# Altium project keyboardV0.1.PrjPCB
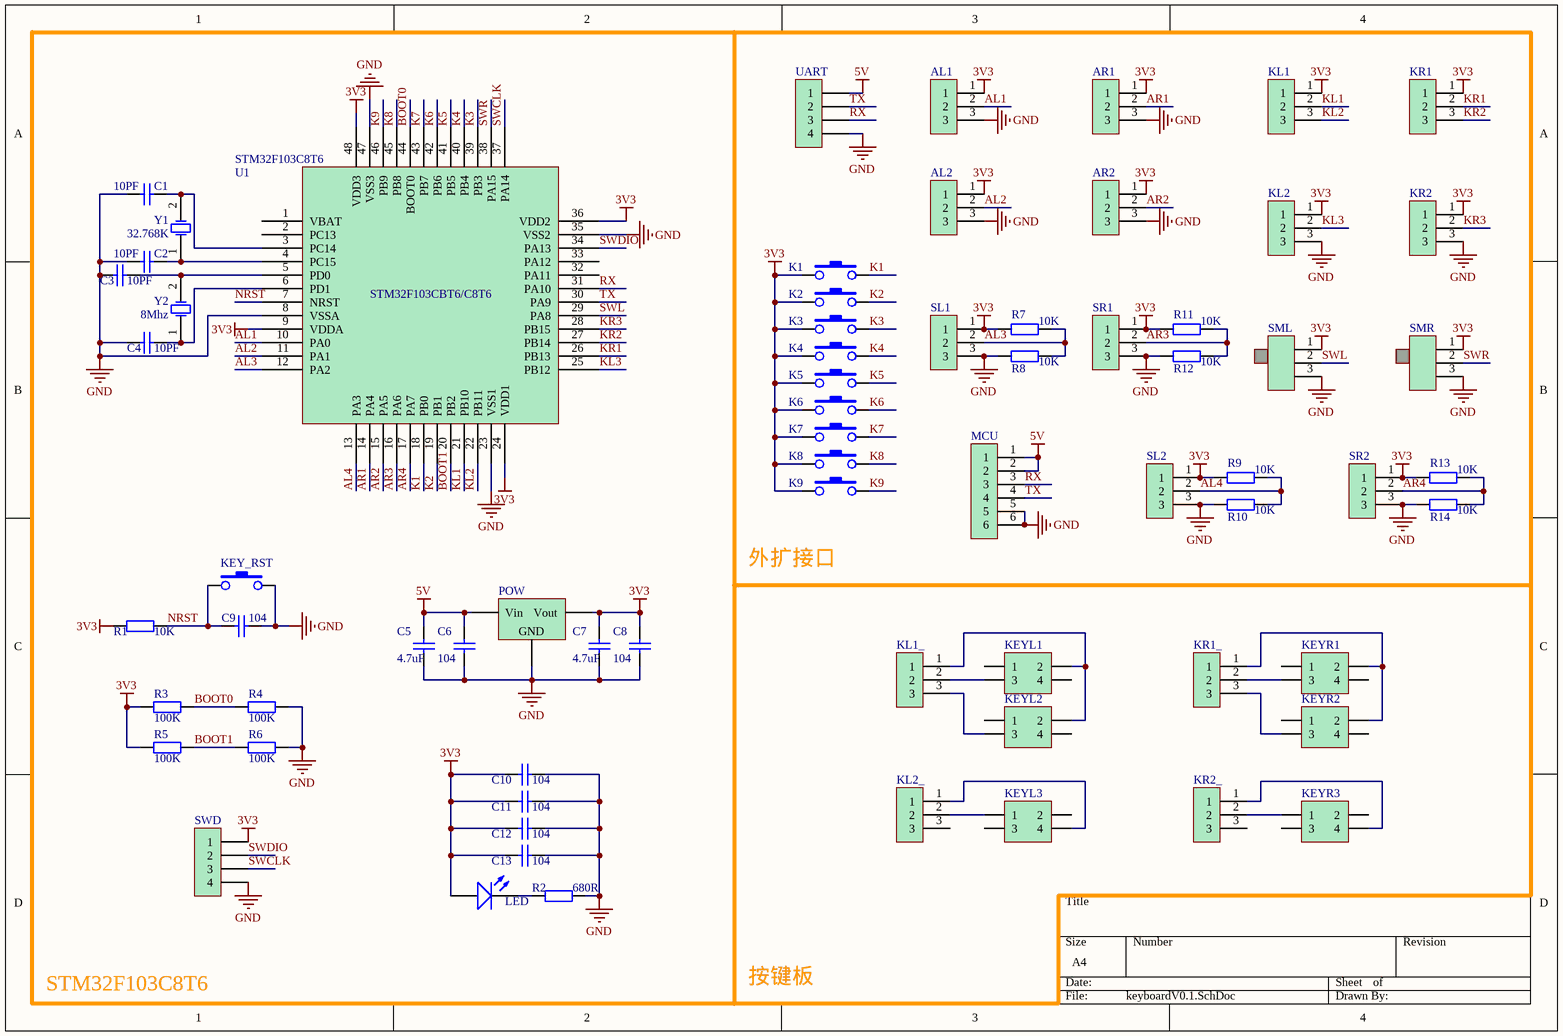
[diagram p0: keyboardV0.1.SchDoc]
1 sheet, 69 parts. Net scope: global (net labels, ports and power ports of the same name join across sheets).
Board file: keyboardV0.1.PcbDoc

## Sheet keyboardV0.1.SchDoc
size A4

### Parts
AL1  SH1.25mm_3P  [SH1.25mm_3P]  (value not drawn)
AL2  SH1.25mm_3P  [SH1.25mm_3P]  (value not drawn)
AR1  SH1.25mm_3P  [SH1.25mm_3P]  (value not drawn)
AR2  SH1.25mm_3P  [SH1.25mm_3P]  (value not drawn)
C1  10PF  [0603_C]
C2  10PF  [0603_C]
C3  10PF  [0603_C]
C4  10PF  [0603_C]
C5  4.7uF  [0603_C]
C6  104  [0603_C]
C7  4.7uF  [0603_C]
C8  104  [0603_C]
C9  104  [0603_C]
C10  104  [0603_C]
C11  104  [0603_C]
C12  104  [0603_C]
C13  104  [0603_C]
K1  KEY_S_6*6  [KEY_S_6*6]  (value not drawn)
K2  KEY_S_6*6  [KEY_S_6*6]  (value not drawn)
K3  KEY_S_6*6  [KEY_S_6*6]  (value not drawn)
K4  KEY_S_6*6  [KEY_S_6*6]  (value not drawn)
K5  KEY_S_6*6  [KEY_S_6*6]  (value not drawn)
K6  KEY_S_6*6  [KEY_S_6*6]  (value not drawn)
K7  KEY_S_6*6  [KEY_S_6*6]  (value not drawn)
K8  KEY_S_6*6  [KEY_S_6*6]  (value not drawn)
K9  KEY_S_6*6  [KEY_S_6*6]  (value not drawn)
KEY_RST  KEY_SMT  [KEY_SMT]  (value not drawn)
KEYL1  KEY  [KEY_6*6]  (value not drawn)
KEYL2  KEY  [KEY_6*6]  (value not drawn)
KEYL3  KEY  [KEY_6*6]  (value not drawn)
KEYR1  KEY  [KEY_6*6]  (value not drawn)
KEYR2  KEY  [KEY_6*6]  (value not drawn)
KEYR3  KEY  [KEY_6*6]  (value not drawn)
KL1  SH1.25mm_3P  [SH1.25mm_3P]  (value not drawn)
KL1_  SH1.25mm_3P  [SH1.25mm_3P]  (value not drawn)
KL2  SH1.25mm_3P  [SH1.25mm_3P]  (value not drawn)
KL2_  SH1.25mm_3P  [SH1.25mm_3P]  (value not drawn)
KR1  SH1.25mm_3P  [SH1.25mm_3P]  (value not drawn)
KR1_  SH1.25mm_3P  [SH1.25mm_3P]  (value not drawn)
KR2  SH1.25mm_3P  [SH1.25mm_3P]  (value not drawn)
KR2_  SH1.25mm_3P  [SH1.25mm_3P]  (value not drawn)
LED  0603_LED  [0603_LED]  (value not drawn)
MCU  SH1.25mm_6P  [SH1.25MM_6P]  (value not drawn)
POW  AMS1117_3.3  [SOT223]  (value not drawn)
R1  10K  [0603_R]
R2  680R  [0603_R]
R3  100K  [0603_R]
R4  100K  [0603_R]
R5  100K  [0603_R]
R6  100K  [0603_R]
R7  10K  [0603_R]
R8  10K  [0603_R]
R9  10K  [0603_R]
R10  10K  [0603_R]
R11  10K  [0603_R]
R12  10K  [0603_R]
R13  10K  [0603_R]
R14  10K  [0603_R]
SL1  SH1.25mm_3P  [SH1.25mm_3P]  (value not drawn)
SL2  SH1.25mm_3P  [SH1.25mm_3P]  (value not drawn)
SML  SWITCH  [SWITCH_SS12F44]  (value not drawn)
SMR  SWITCH  [SWITCH_SS12F44]  (value not drawn)
SR1  SH1.25mm_3P  [SH1.25mm_3P]  (value not drawn)
SR2  SH1.25mm_3P  [SH1.25mm_3P]  (value not drawn)
SWD  Header_2.54_4P  [HDR1_4P]  (value not drawn)
U1  STM32F103C8T6  [LQFP48]
UART  Header_2.54_4P  [HDR1_4P]  (value not drawn)
Y1  32.768K  [XTAL_32.768_3215_2]
Y2  8Mhz  [XTAL_5032_2]

### Blocks framed on the sheet
STM32F103C8T6: C1-C13 KEY_RST LED POW R1-R6 SWD U1 Y1 Y2

### Nets
3V3: AL1.1 AL2.1 AR1.1 AR2.1 C7.1 C8.1 C10.2 C11.2 C12.2 C13.2 K1.1 K2.1 K3.1 K4.1 K5.1 K6.1 K7.1 K8.1 K9.1 KL1.1 KL2.1 KR1.1 KR2.1 LED.A POW.2(Vout) R1.1 R3.2 R5.2 R7.2 R9.2 R11.2 R13.2 SL1.1 SL2.1 SML.1 SMR.1 SR1.1 SR2.1 SWD.1 U1.9(VDDA) U1.24(VDD1) U1.36(VDD2) U1.48(VDD3)
5V: C5.1 C6.1 MCU.1 MCU.2 POW.3(Vin) UART.1
GND: AL1.3 AL2.3 AR1.3 AR2.3 C1.1 C2.1 C3.1 C4.1 C5.2 C6.2 C7.2 C8.2 C9.1 C10.1 C11.1 C12.1 C13.1 KEY_RST.2 KL2.3 KR2.3 MCU.5 MCU.6 POW.1(GND) R2.2 R4.1 R6.1 R8.2 R10.2 R12.2 R14.2 SL1.3 SL2.3 SML.3 SMR.3 SR1.3 SR2.3 SWD.4 U1.8(VSSA) U1.23(VSS1) U1.35(VSS2) U1.47(VSS3) UART.4
AL1: AL1.2 U1.10(PA0)
AL2: AL2.2 U1.11(PA1)
AL3: R7.1 R8.1 SL1.2 U1.12(PA2)
AL4: R9.1 R10.1 SL2.2 U1.13(PA3)
AR1: AR1.2 U1.14(PA4)
AR2: AR2.2 U1.15(PA5)
AR3: R11.1 R12.1 SR1.2 U1.16(PA6)
AR4: R13.1 R14.1 SR2.2 U1.17(PA7)
BOOT0: R3.1 R4.2 U1.44(BOOT0)
BOOT1: R5.1 R6.2 U1.20(PB2)
K1: K1.2 U1.18(PB0)
K2: K2.2 U1.19(PB1)
K3: K3.2 U1.39(PB3)
K4: K4.2 U1.40(PB4)
K5: K5.2 U1.41(PB5)
K6: K6.2 U1.42(PB6)
K7: K7.2 U1.43(PB7)
K8: K8.2 U1.45(PB8)
K9: K9.2 U1.46(PB9)
KL1: KL1.2 U1.21(PB10)
KL2: KL1.3 U1.22(PB11)
KL3: KL2.2 U1.25(PB12)
KR1: KR1.2 U1.26(PB13)
KR2: KR1.3 U1.27(PB14)
KR3: KR2.2 U1.28(PB15)
NRST: C9.2 KEY_RST.1 R1.2 U1.7(NRST)
RX: MCU.3 U1.31(PA10) UART.3
SWCLK: SWD.3 U1.37(PA14)
SWDIO: SWD.2 U1.34(PA13)
SWL: SML.2 U1.29(PA8)
SWR: SMR.2 U1.38(PA15)
TX: MCU.4 U1.30(PA9) UART.2
NetC1_2: C1.2 U1.3(PC14) Y1.2(OSC2)
NetC2_2: C2.2 U1.4(PC15) Y1.1(OSC1)
NetC3_2: C3.2 U1.5(PD0) Y2.2(OSC2)
NetC4_2: C4.2 U1.6(PD1) Y2.1(OSC1)
NetKEYL1_2: KEYL1.2 KEYL2.2 KL1_.1
NetKEYL1_3: KEYL1.3 KL1_.2
NetKEYL2_3: KEYL2.3 KL1_.3
NetKEYL3_1: KEYL3.1 KL2_.2
NetKEYL3_4: KEYL3.4 KL2_.1
NetKEYR1_2: KEYR1.2 KEYR2.2 KR1_.1
NetKEYR1_3: KEYR1.3 KR1_.2
NetKEYR2_3: KEYR2.3 KR1_.3
NetKEYR3_1: KEYR3.1 KR2_.2
NetKEYR3_4: KEYR3.4 KR2_.1
NetLED_K: LED.K R2.1

Not connected (* = marked no-connect by the designer): KEYL1 1 4; KEYL2 1 4; KEYL3 2 3; KEYR1 1 4; KEYR2 1 4; KEYR3 2 3; KL2_ 3; KR2_ 3; U1 1(VBAT) 2(PC13) 32(PA11) 33(PA12)

### Notes on the sheet
- 外扩接口
- 按键板
- (in symbol STM32F103C8T6) STM32F103CBT6/C8T6

### Library data of the parts
C1-C13 = 0603_CAP
KEYL1-KEYL3 KEYR1-KEYR3 = KEY_6*6
R1-R14 = 0603_RES
SML SMR = SWITCH_SS12F44
Y1 = XTAL_32.768_3215_2
Y2 = XTAL_8MHz_5032_2